# EAGLE design db25-to-dale26 (EAGLE 7.4.0)
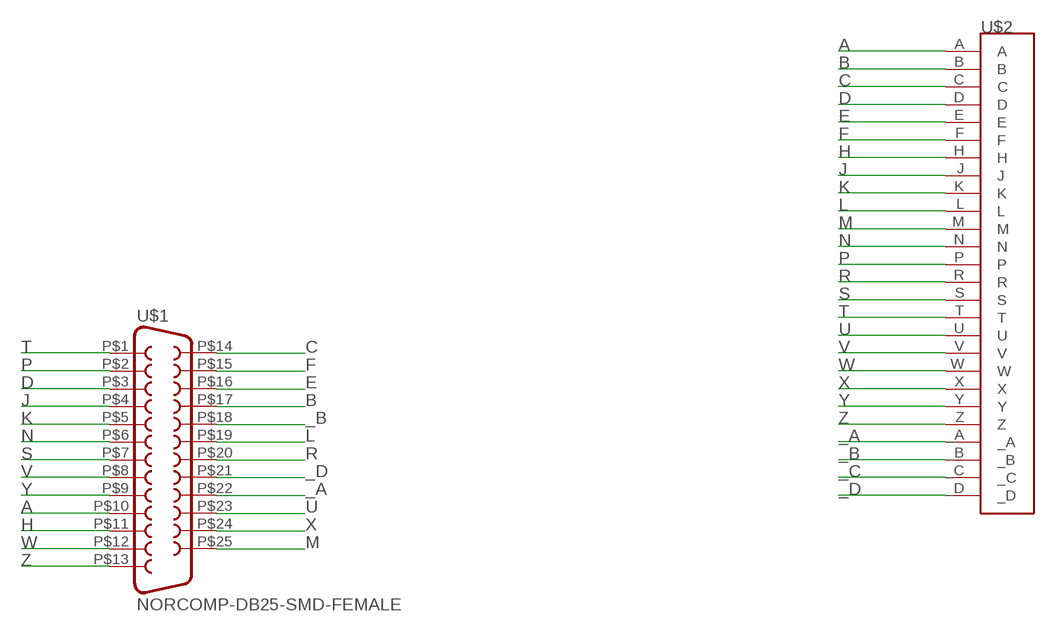
[diagram p0: schematic, sheet 1]

## Parts
U$1  NORCOMP-DB25-SMD-FEMALE  [190-025-263R001]
U$2  MMD1P22G-26-M101  [MMD1P22G-26-M101]

## Nets
_A: U$1.P$22 U$2._A
_B: U$1.P$18 U$2._B
_C: U$2._C
_D: U$1.P$21 U$2._D
A: U$1.P$10 U$2.A
B: U$1.P$17 U$2.B
C: U$1.P$14 U$2.C
D: U$1.P$3 U$2.D
E: U$1.P$16 U$2.E
F: U$1.P$15 U$2.F
H: U$1.P$11 U$2.H
J: U$1.P$4 U$2.J
K: U$1.P$5 U$2.K
L: U$1.P$19 U$2.L
M: U$1.P$25 U$2.M
N: U$1.P$6 U$2.N
P: U$1.P$2 U$2.P
R: U$1.P$20 U$2.R
S: U$1.P$7 U$2.S
T: U$1.P$1 U$2.T
U: U$1.P$23 U$2.U
V: U$1.P$8 U$2.V
W: U$1.P$12 U$2.W
X: U$1.P$24 U$2.X
Y: U$1.P$9 U$2.Y
Z: U$1.P$13 U$2.Z

## Library data of the parts
U$1 = michael-stetner:NORCOMP-DB25-SMD-FEMALE
U$2 = elm:MMD1P22G-26-M101

## Board
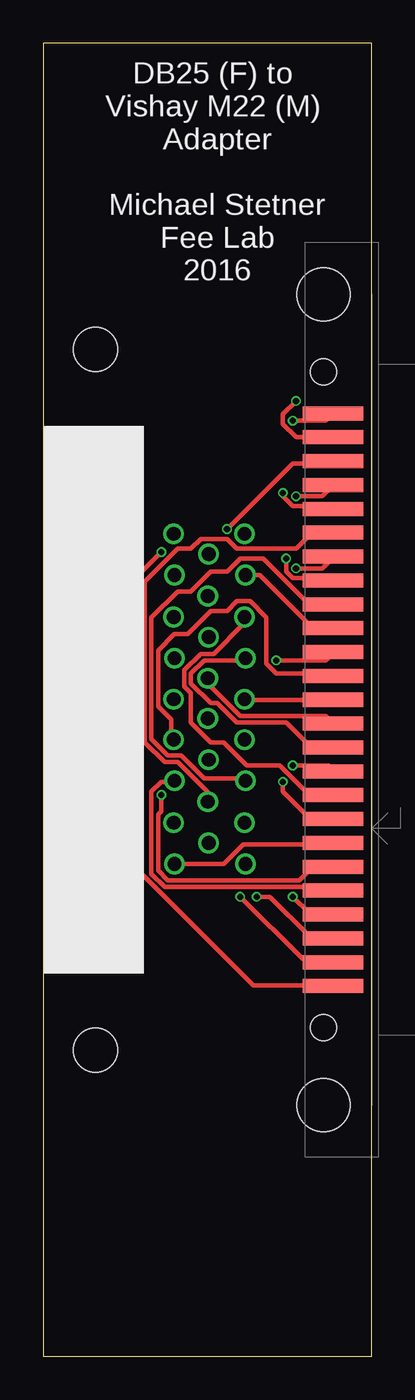
[diagram p1: board, top side]
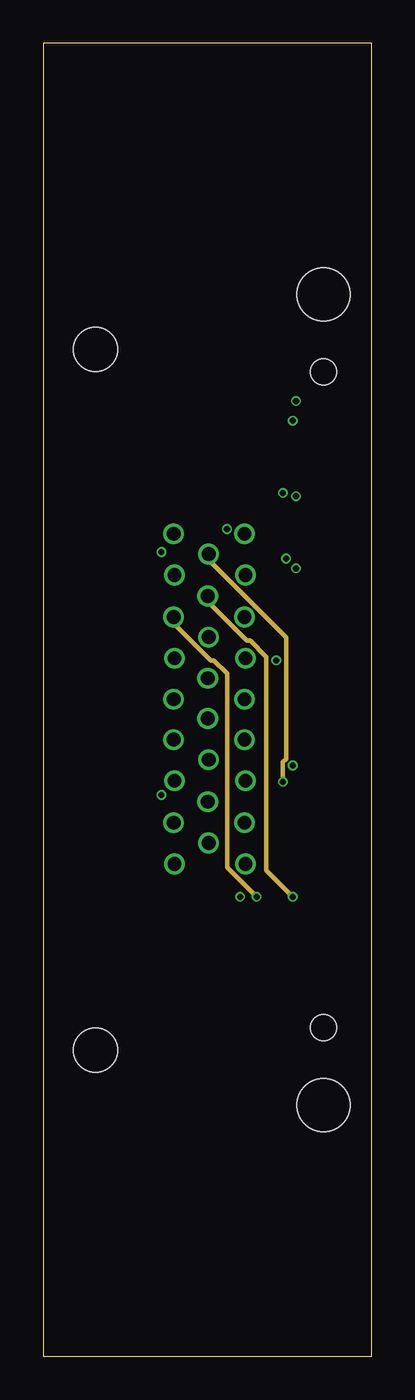
[diagram p2: board, inner layer Route2]
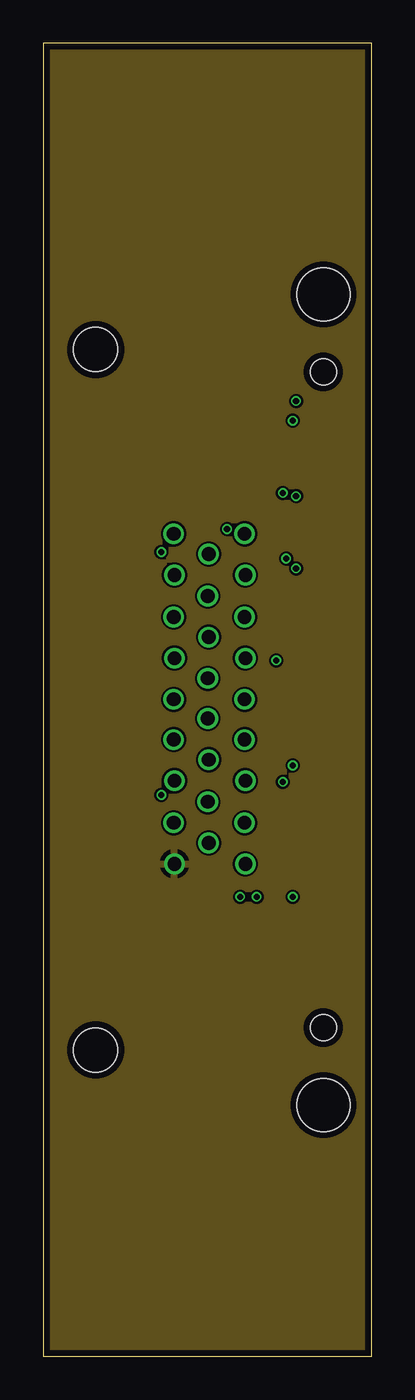
[diagram p3: board, inner layer Route15]
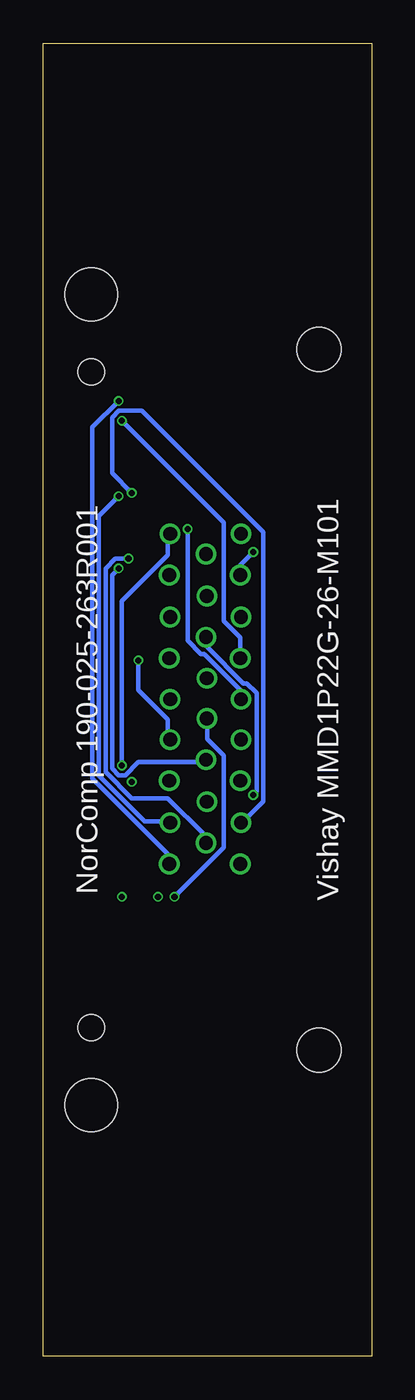
[diagram p4: board, bottom side, seen from below]

Size 19.05 x 76.2 mm. Coordinates in mm from the lower left corner, seen from the top.
Outline: 0,0 19.05,0 19.05,76.2 0,76.2 0,0
Copper layers (1*2*15*16): Top 0.035559375mm / dielectric 0.17018125mm / Route2 0.01778125mm / dielectric 47mil / Route15 0.01778125mm / dielectric 0.17018125mm / Bottom 0.035559375mm
Design rules "OSHPark-4layer *": minimum track width 10mil, minimum drill 14mil, track to track 5mil, track to pad 5mil, pad to pad 5mil, via to via 5mil, smd to smd 5mil, copper to edge 15mil, drill to drill 6mil, minimum pad ring 4mil, minimum via ring 4mil, stop-mask expansion 2.5mil, vias tented up to drill 0mil, thermal gap 10mil
Holes 2.54 mm at 3.05,58.42 3.05,17.78

### Footprints (pad centres in the part's own frame; a part is rotated, then mirrored left to right if it is on the bottom)
190-025-263R001 = smd 0.813 x 3.505: P$1 -16.612,-2.235; P$2 -13.843,-2.235; P$3 -11.074,-2.235; P$4 -8.306,-2.235; P$5 -5.537,-2.235; P$6 -2.769,-2.235; P$7 0,-2.235; P$8 2.769,-2.235; P$9 5.537,-2.235; P$10 8.306,-2.235; P$11 11.074,-2.235; P$12 13.843,-2.235; P$13 16.612,-2.235; P$14 -15.227,-2.235; P$15 -12.459,-2.235; P$16 -9.69,-2.235; P$17 -6.921,-2.235; P$18 -4.153,-2.235; P$19 -1.384,-2.235; P$20 1.384,-2.235; P$21 4.153,-2.235; P$22 6.921,-2.235; P$23 9.69,-2.235; P$24 12.459,-2.235; P$25 15.227,-2.235 | hole 3.048: -23.52,-2.794; 23.52,-2.794 | hole 1.499: -19.025,-2.794; 19.025,-2.794
MMD1P22G-26-M101 = drill 0.8: _A 9.601,8.458; _B 11.735,7.239; _C 7.569,9.627; _D 11.684,9.627; A 7.62,-9.525; B 9.601,-8.306; C 11.735,-9.525; D 7.569,-7.137; E 9.55,-5.918; F 11.684,-7.137; H 7.62,-4.699; J 9.601,-3.48; K 11.735,-4.699; L 7.569,-2.311; M 9.55,-1.092; N 11.684,-2.311; P 7.569,0.025; R 9.55,1.245; S 11.684,0.025; T 7.62,2.413; U 9.601,3.632; V 11.735,2.413; W 7.569,4.801; X 9.55,6.02; Y 11.684,4.801; Z 7.62,7.239

### Placement (x,y rotation side)
U$1  19.05,38.1 270 top
U$2  0,38.1 0 top

### Tracks (layer width: path | path; a pad name or v marks a point on that pad's centre or on a via)
_A  (via drill 0.36)
  Top 0.254: v13.91,33.34 13.91,32.77 15.43,31.24 16.76,31.24 U$1.P$22
  Route2 0.254: v13.91,33.34 13.91,34.48 14.1,34.67 14.1,41.72 9.72,46.1 9.72,46.48 U$2._A
_B
  Top 0.254: U$2._B 12.57,45.34 15.62,42.29 16.76,42.29 U$1.P$18
_D  (via drill 0.36)
  Top 0.254: v14.48,34.29 16.57,34.29 16.76,34.1 U$1.P$21
  Bottom 0.254: v14.48,34.29 14.48,43.81 11.81,46.48 11.81,47.62 U$2._D
A
  Top 0.254: U$2.A 10.48,28.57 11.62,29.72 16.76,29.72 U$1.P$10
  pour Route15: 0,0 19.05,0 19.05,76.2 0,76.2
B  (via drill 0.36)
  Top 0.254: v14.1,46.29 14.1,45.53 14.48,45.15 16.76,45.15 U$1.P$17
  Bottom 0.254: v14.1,46.29 14.86,46.29 15.43,45.72 15.43,33.91 13.91,32.38 11.81,32.38 9.72,30.29 9.72,29.91 U$2.B
C  (via drill 0.36)
  Top 0.254: v14.67,55.44 13.91,54.67 13.91,54.1 14.67,53.34 16.76,53.34 U$1.P$14
  Bottom 0.254: v14.67,55.44 16.19,53.91 16.19,33.53 11.81,29.15 11.81,28.57 U$2.C
D  (via drill 0.36)
  Top 0.254: v13.91,50.1 13.91,49.91 14.48,49.34 16.76,49.34 U$1.P$3
  Bottom 0.254: v13.91,50.1 15.05,51.24 15.05,54.48 14.67,54.86 13.34,54.86 6.29,47.82 6.29,32.19 7.43,31.05 U$2.D
E
  Top 0.254: U$2.E 9.53,32.19 9.53,32.77 7.81,34.48 7.05,34.48 5.91,35.62 5.91,44.96 7.81,46.86 8.57,46.86 9.14,47.43 10.67,47.43 11.24,46.86 14.67,46.86 15.43,47.62 16.76,47.62 U$1.P$16
F  (via drill 0.36)
  Top 0.254: v14.67,49.91 16.19,49.91 16.76,50.48 U$1.P$15
  Bottom 0.254: v14.67,49.91 15.81,48.77 15.81,33.72 13.14,31.05 11.81,31.05 U$2.F
H
  Top 0.254: U$2.H 7.62,33.34 6.86,33.34 6.29,32.77 6.29,28 7.05,27.24 16.57,27.24 16.76,27.05 U$1.P$11
J  (via drill 0.36)
  Top 0.254: v14.67,45.72 16.19,45.72 16.76,46.29 U$1.P$4
  Bottom 0.254: v14.67,45.72 15.05,45.34 15.05,34.1 14.67,33.72 14.29,33.72 13.53,34.48 9.72,34.48 U$2.J
K
  Top 0.254: U$2.K 11.62,33.53 9.34,33.53 8,34.86 7.24,34.86 6.29,35.81 6.29,42.86 7.81,44.39 8.57,44.39 9.72,45.53 10.67,45.53 11.43,46.29 12.76,46.29 15.24,43.81 16.76,43.81 U$1.P$5
L
  Top 0.254: U$2.L 7.43,35.81 7.43,36.96 6.67,37.72 6.67,40.96 7.62,41.91 8.38,41.91 9.72,43.24 10.67,43.24 11.24,43.81 12,43.81 12.95,42.86 12.95,40.2 13.53,39.62 16.76,39.62 U$1.P$19
M  (via drill 0.36)
  Top 0.254: v11.43,26.67 15.05,23.05 16.76,23.05 U$1.P$25
  Bottom 0.254: v11.43,26.67 8.57,29.53 8.57,34.86 9.53,35.81 9.53,36.96 U$2.M
N  (via drill 0.36)
  Top 0.254: v13.53,40.39 16.38,40.39 16.76,40.77 U$1.P$6
  Bottom 0.254: v13.53,40.39 13.53,38.67 11.81,36.96 11.81,35.81 U$2.N
P  (via drill 0.36)
  Top 0.254: v10.67,48.01 14.48,51.82 16.76,51.82 U$1.P$2
  Bottom 0.254: v10.67,48.01 10.67,41.53 9.91,40.77 9.72,40.77 7.62,38.67 7.62,38.29 U$2.P
R
  Top 0.254: U$1.P$20 16.38,37.15 11.43,37.15 9.72,38.86 9.72,39.24 U$2.R
S
  Top 0.254: U$1.P$7 11.81,38.1 U$2.S
T  (via drill 0.36)
  Top 0.254: v14.48,54.29 16.38,54.29 16.76,54.67 U$1.P$1
  Bottom 0.254: U$2.T 7.62,41.72 8.57,42.67 8.57,48.39 v14.48,54.29
U  (via drill 0.36)
  Top 0.254: v6.86,32.58 6.86,31.62 6.67,31.43 6.67,28.19 7.24,27.62 14.86,27.62 15.62,28.38 16.76,28.38 U$1.P$23
  Bottom 0.254: v6.86,32.58 6.67,32.77 6.67,38.48 7.24,39.05 7.43,39.05 9.53,41.15 9.53,41.72 U$2.U
V
  Top 0.254: U$2.V 11.62,40.39 9.34,40.39 8.57,39.62 8.57,39.05 9.72,37.91 10.1,37.91 11.24,36.77 14.1,36.77 15.43,35.43 16.76,35.43 U$1.P$8
W  (via drill 0.36)
  Top 0.254: v12.38,26.67 13.14,26.67 15.43,24.38 16.76,24.38 U$1.P$12
  Route2 0.254: v12.38,26.67 10.67,28.38 10.67,39.62 9.91,40.39 9.72,40.39 7.62,42.48 7.62,42.86 U$2.W
X  (via drill 0.36)
  Top 0.254: v14.48,26.67 15.43,25.72 16.76,25.72 U$1.P$24
  Route2 0.254: v14.48,26.67 12.95,28.19 12.95,40.58 12,41.53 11.81,41.53 9.72,43.62 9.72,44.01 U$2.X
Y
  Top 0.254: U$2.Y 11.62,42.86 11.62,42.48 9.91,40.77 9.14,40.77 8.19,39.81 8.19,38.86 8.57,38.48 8.57,36.77 9.72,35.62 10.48,35.62 11.81,34.29 13.72,34.29 15.43,32.58 16.76,32.58 U$1.P$9
Z  (via drill 0.36)
  Top 0.254: v6.86,46.67 5.52,45.34 5.52,28.19 12.19,21.53 16.76,21.53 U$1.P$13
  Bottom 0.254: U$2.Z 7.62,45.91 v6.86,46.67

### Text on the board
tPlace: DB25 (F) to / Vishay M22 (M) / Adapter / / Michael Stetner / Fee Lab / 2016
bPlace: Vishay MMD1P22G-26-M101 | NorComp 190-025-263R001